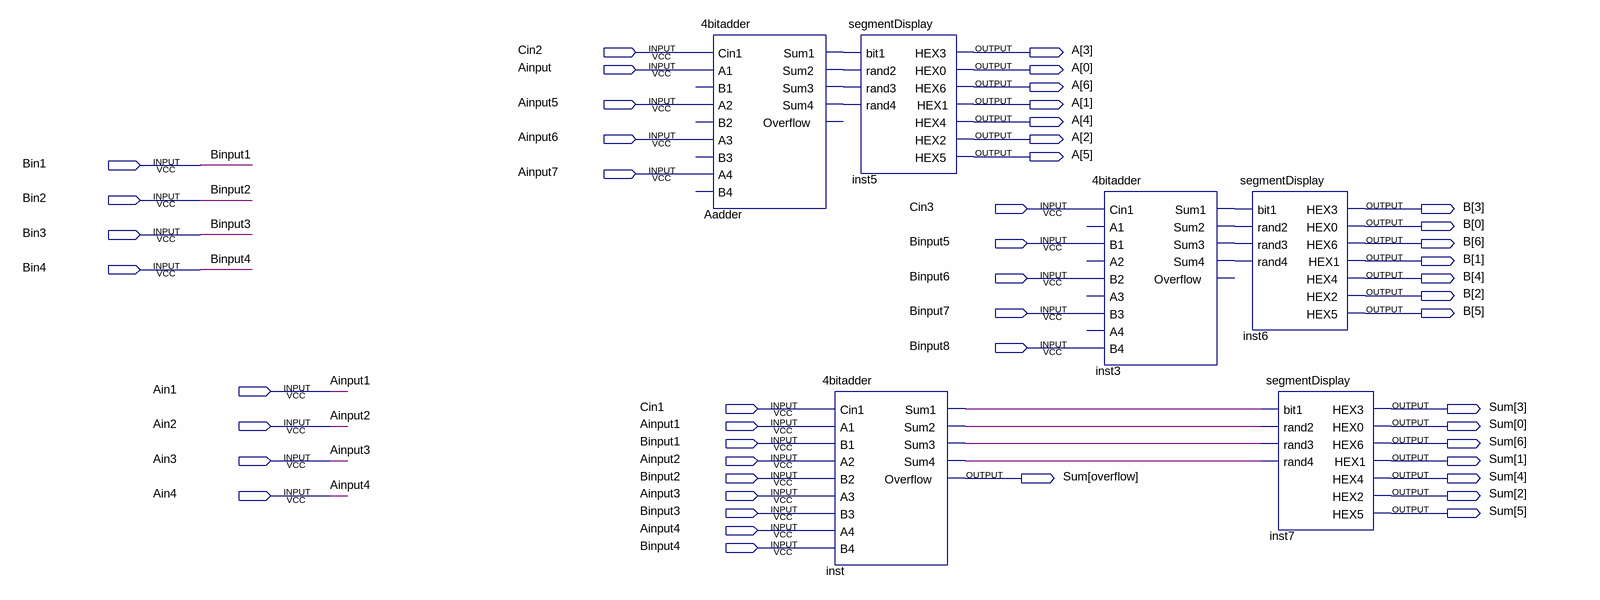
[diagram p0: schematic sheet]
// Quartus schematic segmentDisplay4bitAdder.bdf as structural Verilog: 6 symbols, 49 pins
module segmentDisplay4bitAdder (
  input  Cin2,
  input  Ainput,
  input  Ainput5,
  input  Ainput6,
  input  Bin1,
  input  Ainput7,
  input  Bin2,
  input  Cin3,
  input  Bin3,
  input  Binput5,
  input  Bin4,
  input  Binput6,
  input  Binput7,
  input  Binput8,
  input  Ain1,
  input  Cin1,
  input  Ain2,
  input  Ainput1,
  input  Binput1,
  input  Ain3,
  input  Ainput2,
  input  Binput2,
  input  Ain4,
  input  Ainput3,
  input  Binput3,
  input  Ainput4,
  input  Binput4,
  output [6:0] A,
  output [6:0] B,
  output [6:0] Sum,
  output \Sum[overflow] 
);

  wire Aadder_sum1, Aadder_sum2, Aadder_sum3, Aadder_sum4, inst3_sum1, inst3_sum2, inst3_sum3, inst3_sum4,
       inst_sum1, inst_sum2, inst_sum3, inst_sum4;

  \4bitadder  Aadder (
    .Cin1(Cin2), .A1(Ainput), .A2(Ainput5), .A3(Ainput6), .A4(Ainput7), .Sum1(Aadder_sum1),
    .Sum2(Aadder_sum2), .Sum3(Aadder_sum3), .Sum4(Aadder_sum4));  // open: B1, B2, B3, B4, Overflow
  segmentDisplay inst5 (
    .bit1(Aadder_sum1), .rand2(Aadder_sum2), .rand3(Aadder_sum3), .rand4(Aadder_sum4), .HEX3(A[3]),
    .HEX0(A[0]), .HEX6(A[6]), .HEX1(A[1]), .HEX4(A[4]), .HEX2(A[2]), .HEX5(A[5]));
  \4bitadder  inst (
    .Cin1(Cin1), .A1(Ain1), .B1(Bin1), .A2(Ain2), .B2(Bin2), .A3(Ain3), .B3(Bin3), .A4(Ain4), .B4(Bin4),
    .Sum1(inst_sum1), .Sum2(inst_sum2), .Sum3(inst_sum3), .Sum4(inst_sum4), .Overflow(\Sum[overflow] ));
  \4bitadder  inst3 (
    .Cin1(Cin3), .B1(Binput5), .B2(Binput6), .B3(Binput7), .B4(Binput8), .Sum1(inst3_sum1),
    .Sum2(inst3_sum2), .Sum3(inst3_sum3), .Sum4(inst3_sum4));  // open: A1, A2, A3, A4, Overflow
  segmentDisplay inst6 (
    .bit1(inst3_sum1), .rand2(inst3_sum2), .rand3(inst3_sum3), .rand4(inst3_sum4), .HEX3(B[3]), .HEX0(B[0]),
    .HEX6(B[6]), .HEX1(B[1]), .HEX4(B[4]), .HEX2(B[2]), .HEX5(B[5]));
  segmentDisplay inst7 (
    .bit1(inst_sum1), .rand2(inst_sum2), .rand3(inst_sum3), .rand4(inst_sum4), .HEX3(Sum[3]), .HEX0(Sum[0]),
    .HEX6(Sum[6]), .HEX1(Sum[1]), .HEX4(Sum[4]), .HEX2(Sum[2]), .HEX5(Sum[5]));

  assign Ainput1 = Ain1;
  assign Ainput2 = Ain2;
  assign Ainput3 = Ain3;
  assign Ainput4 = Ain4;
  assign Binput1 = Bin1;
  assign Binput2 = Bin2;
  assign Binput3 = Bin3;
  assign Binput4 = Bin4;
endmodule
